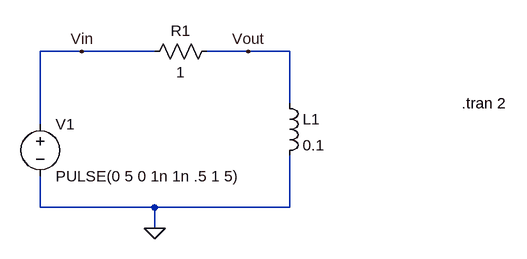
[diagram p0: schematic RL_Circuit.asc]
RL_Circuit.asc, the LTspice schematic file:
Version 4.1
SHEET 1 880 680
WIRE -608 -80 -672 -80
WIRE -496 -80 -608 -80
WIRE -352 -80 -416 -80
WIRE -288 -80 -352 -80
WIRE -288 0 -288 -80
WIRE -672 32 -672 -80
WIRE -672 160 -672 112
WIRE -496 160 -672 160
WIRE -288 160 -288 80
WIRE -288 160 -496 160
WIRE -496 192 -496 160
FLAG -496 192 0
FLAG -608 -80 Vin
FLAG -352 -80 Vout
SYMBOL res -400 -96 R90
WINDOW 0 0 56 VBottom 2
WINDOW 3 32 56 VTop 2
SYMATTR InstName R1
SYMATTR Value 1
SYMBOL ind -304 -16 R0
SYMATTR InstName L1
SYMATTR Value 0.1
SYMBOL voltage -672 16 R0
WINDOW 123 0 0 Left 0
WINDOW 39 0 0 Left 0
SYMATTR InstName V1
SYMATTR Value PULSE(0 5 0 1n 1n .5 1 5)
TEXT -24 0 Left 2 !.tran 2

The netlist it stands for:
* RL_Circuit.asc
R1 Vout Vin 1
L1 Vout 0 0.1
V1 Vin 0 PULSE(0 5 0 1n 1n .5 1 5)
.tran 2
.backanno
.end